# EAGLE design dropper_torpedo (EAGLE 9.6.1)
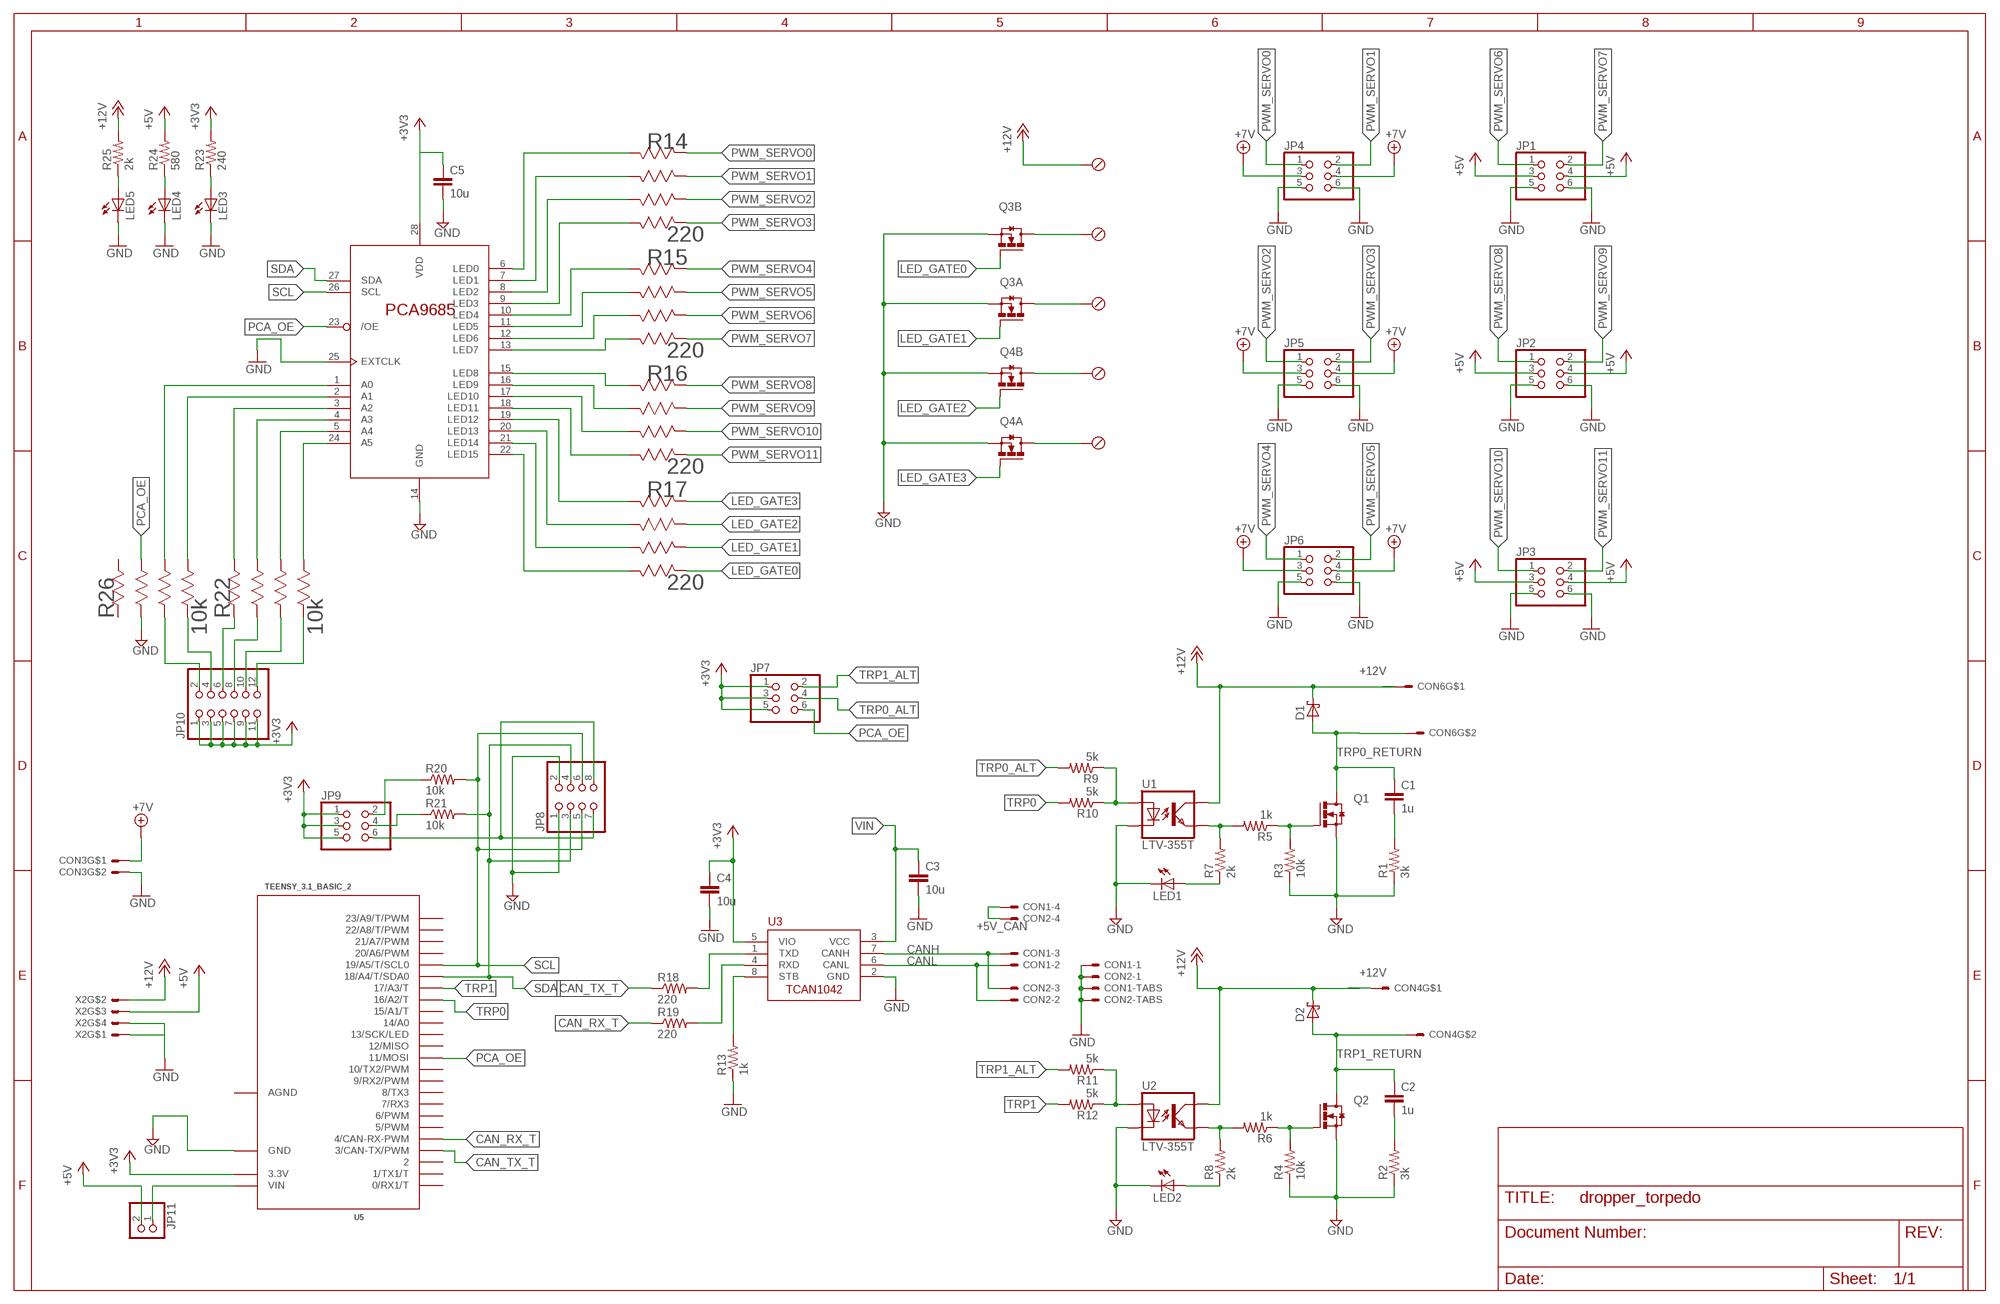
[diagram p0: schematic, sheet 1]

## Parts
C1  1u  C-EUC1206  [C1206]
C2  1u  C-EUC1206  [C1206]
C3  10u  C-EUC0805  [C0805]
C4  10u  C-EUC0805  [C0805]
C5  10u  C-EUC0805  [C0805]
CON1  SM04B-GHS-TB  [SM04B-GHS-TB]
CON2  SM04B-GHS-TB  [SM04B-GHS-TB]
CON3  MOLEX_5566-2  [5566-2]
CON4  MOLEX_5566-2  [5566-2]
CON6  MOLEX_5566-2  [5566-2]
D1  STPS1L30A  [DO214AC]
D2  STPS1L30A  [DO214AC]
JP1  PINHD-2X3  [2X03]
JP2  PINHD-2X3  [2X03]
JP3  PINHD-2X3  [2X03]
JP4  PINHD-2X3  [2X03]
JP5  PINHD-2X3  [2X03]
JP6  PINHD-2X3  [2X03]
JP7  PINHD-2X3  [2X03]
JP8  PINHD-2X4  [2X04]
JP9  PINHD-2X3  [2X03]
JP10  PINHD-2X6  [2X06]
JP11  PINHD-1X2  [1X02]
LED1  LEDCHIPLED_1206  [CHIPLED_1206]
LED2  LEDCHIPLED_1206  [CHIPLED_1206]
LED3  LEDCHIPLED_1206  [CHIPLED_1206]
LED4  LEDCHIPLED_1206  [CHIPLED_1206]
LED5  LEDCHIPLED_1206  [CHIPLED_1206]
Q1  SI4896DY-T1-E3  [SO-8]
Q2  SI4896DY-T1-E3  [SO-8]
Q3  IRL6372TRPBF  [SO-8]
Q4  IRL6372TRPBF  [SO-8]
R1  3k  R-US_R1206  [R1206]
R2  3k  R-US_R1206  [R1206]
R3  10k  R-US_R1206  [R1206]
R4  10k  R-US_R1206  [R1206]
R5  1k  R-US_R1206  [R1206]
R6  1k  R-US_R1206  [R1206]
R7  2k  R-US_R1206  [R1206]
R8  2k  R-US_R1206  [R1206]
R9  5k  R-US_R0805  [R0805]
R10  5k  R-US_R0805  [R0805]
R11  5k  R-US_R0805  [R0805]
R12  5k  R-US_R0805  [R0805]
R13  1k  R-US_R0805  [R0805]
R14  220  EXB-V8V221JVEXBV8V-M  [EXBV8V-M]
R15  220  EXB-V8V221JVEXBV8V-M  [EXBV8V-M]
R16  220  EXB-V8V221JVEXBV8V-M  [EXBV8V-M]
R17  220  EXB-V8V221JVEXBV8V-M  [EXBV8V-M]
R18  220  R-US_R0805  [R0805]
R19  220  R-US_R0805  [R0805]
R20  10k  R-US_R1206  [R1206]
R21  10k  R-US_R1206  [R1206]
R22  10k  EXB-V8V221JVEXBV8V-M  [EXBV8V-M]
R23  240  R-US_R1206  [R1206]
R24  580  R-US_R1206  [R1206]
R25  2k  R-US_R1206  [R1206]
R26  10k  EXB-V8V221JVEXBV8V-M  [EXBV8V-M]
U1  LTV-355T  [SMD4]
U2  LTV-355T  [SMD4]
U3  TCAN1042HVDR  [SO-8]
U4  PCA9685PW  [TSSOP28]
U5  TEENSY_3.1_BASIC_2  [TEENSY_3.1_BASIC_2]
X1  OSTVN05A150  [OSTVN05A150]
X2  MOLEX_5566-4  [5566-4]

## Nets
+3V3: C4.1 C5.1 JP7.1 JP7.3 JP7.5 JP9.1 JP9.3 JP9.5 JP10.1 JP10.3 JP10.5 JP10.7 JP10.9 JP10.11 R23.2 U3.5(VIO) U4.28(VDD) U5.3.3V
+5V: JP1.3 JP1.4 JP2.3 JP2.4 JP3.3 JP3.4 JP11.2 R24.2 X2.3
+5V_CAN: CON1.P$4 CON2.P$4
+7V: CON3.1 JP4.3 JP4.4 JP5.3 JP5.4 JP6.3 JP6.4
+12V: CON4.1 CON6.1 D1.C D2.C R25.2 U1.COLLECTOR(COL) U2.COLLECTOR(COL) X1.P$5 X2.2
A0: R26.6 U4.1(A0)
A0+: JP10.2 R26.3
A1: R26.5 U4.2(A1)
A1+: JP10.4 R26.4
A2: R22.8 U4.3(A2)
A2+: JP10.6 R22.1
A3: R22.7 U4.4(A3)
A3+: JP10.8 R22.2
A4: R22.6 U4.5(A4)
A4+: JP10.10 R22.3
A5: R22.5 U4.24(A5)
A5+: JP10.12 R22.4
CAN_RX: R19.2 U3.4(RXD)
CAN_RX_T: R19.1 U5.4(4/CAN-RX-PWM)
CAN_TX1: R18.2 U3.1(TXD)
CAN_TX_T: R18.1 U5.3(3/CAN-TX/PWM)
CANH: CON1.P$3 CON2.P$3 U3.7(CANH)
CANL: CON1.P$2 CON2.P$2 U3.6(CANL)
GND [net1]: C3.2 C4.2 C5.2 CON1.P$1 CON1.P$5 CON1.P$6 CON2.P$1 CON2.P$5 CON2.P$6 CON3.2 JP1.5 JP1.6 JP2.5 JP2.6 JP3.5 JP3.6 JP4.5 JP4.6 JP5.5 JP5.6 JP6.5 JP6.6 JP8.1 JP8.2 LED1.C LED2.C LED3.C LED4.C LED5.C Q1.1(S) Q1.2(S) Q1.3(S) Q2.1(S) Q2.2(S) Q2.3(S) Q3.1(B:S) Q3.3(A:S) Q4.1(B:S) Q4.3(A:S) R1.1 R2.1 R3.1 R4.1 R13.1 R26.2 U1.CATHODE(C) U2.CATHODE(C) U3.2(GND) U4.14(GND) U4.25(EXTCLK) U5.GND X2.1 X2.4
I2C_3V3: JP8.7 JP8.8 JP9.6
LED_DRAIN0: Q3.7(B:D) Q3.8(B:D) X1.P$4
LED_DRAIN1: Q3.5(A:D) Q3.6(A:D) X1.P$3
LED_DRAIN2: Q4.7(B:D) Q4.8(B:D) X1.P$2
LED_DRAIN3: Q4.5(A:D) Q4.6(A:D) X1.P$1
LED_GATE0: Q3.2(B:G) R17.4
LED_GATE1: Q3.4(A:G) R17.3
LED_GATE2: Q4.2(B:G) R17.2
LED_GATE3: Q4.4(A:G) R17.1
N$1: LED1.A R7.1
N$2: LED2.A R8.1
N$3: LED3.A R23.1
N$4: LED4.A R24.1
N$5: LED5.A R25.1
PCA_OE: JP7.6 R26.7 U4.23(/OE) U5.11(11/MOSI)
PWM_CH0: R14.8 U4.6(LED0)
PWM_CH1: R14.7 U4.7(LED1)
PWM_CH2: R14.6 U4.8(LED2)
PWM_CH3: R14.5 U4.9(LED3)
PWM_CH4: R15.8 U4.10(LED4)
PWM_CH5: R15.7 U4.11(LED5)
PWM_CH6: R15.6 U4.12(LED6)
PWM_CH7: R15.5 U4.13(LED7)
PWM_CH8: R16.8 U4.15(LED8)
PWM_CH9: R16.7 U4.16(LED9)
PWM_CH10: R16.6 U4.17(LED10)
PWM_CH11: R16.5 U4.18(LED11)
PWM_CH12: R17.8 U4.19(LED12)
PWM_CH13: R17.7 U4.20(LED13)
PWM_CH14: R17.6 U4.21(LED14)
PWM_CH15: R17.5 U4.22(LED15)
PWM_SERVO0: JP4.1 R14.1
PWM_SERVO1: JP4.2 R14.2
PWM_SERVO2: JP5.1 R14.3
PWM_SERVO3: JP5.2 R14.4
PWM_SERVO4: JP6.1 R15.1
PWM_SERVO5: JP6.2 R15.2
PWM_SERVO6: JP1.1 R15.3
PWM_SERVO7: JP1.2 R15.4
PWM_SERVO8: JP2.1 R16.1
PWM_SERVO9: JP2.2 R16.2
PWM_SERVO10: JP3.1 R16.3
PWM_SERVO11: JP3.2 R16.4
RC0: C1.2 R1.2
RC1: C2.2 R2.2
SCL: JP8.5 JP8.6 R20.2 U4.26(SCL) U5.19/A5(19/A5/T/SCL0)
SCL_3V3: JP9.2 R20.1
SDA: JP8.3 JP8.4 R21.2 U4.27(SDA) U5.18/A4(18/A4/T/SDA0)
SDA_3V3: JP9.4 R21.1
STB: R13.2 U3.8(STB)
TOPTO_A0: R9.1 R10.1 U1.ANODE(A)
TOPTO_A1: R11.1 R12.1 U2.ANODE(A)
TOPTO_E0: R5.2 R7.2 U1.EMITTER(EMIT)
TOPTO_E1: R6.2 R8.2 U2.EMITTER(EMIT)
TRP0: R10.2 U5.16/A2(16/A2/T)
TRP0_ALT: JP7.4 R9.2
TRP0_RETURN: CON6.2
TRP1: R12.2 U5.17/A3(17/A3/T)
TRP1_ALT: JP7.2 R11.2
TRP1_RETURN: C2.1 CON4.2 D2.A Q2.5(D) Q2.6(D) Q2.7(D) Q2.8(D)
TRP_GATE0: Q1.4(G) R3.2 R5.1
TRP_GATE1: Q2.4(G) R4.2 R6.1
TRP_RETURN0: C1.1 D1.A Q1.5(D) Q1.6(D) Q1.7(D) Q1.8(D)
VIN: C3.1 JP11.1 U3.3(VCC) U5.VIN
Unconnected: R26.1 R26.8 U5.0(0/RX1/T) U5.1(1/TX1/T) U5.2 U5.5(5/PWM) U5.6(6/PWM) U5.7(7/RX3) U5.8(8/TX3) U5.9(9/RX2/PWM) U5.10(10/TX2/PWM) U5.12(12/MISO) U5.13(13/SCK/LED) U5.14/A0 U5.15/A1(15/A1/T) U5.20/A6(20/A6/PWM) U5.21/A7(21/A7/PWM) U5.22/A8(22/A8/T/PWM) U5.23/A9(23/A9/T/PWM)

## Power pins joined to a net without a drawn wire
AGND: U5.AGND

## Library data of the parts
C1-C5 = rcl:C-EU: CAPACITOR, European symbol
CON1 CON2 = ARVP:SM04B-GHS-TB
CON3 CON4 CON6 = ARVP:MOLEX_5566-2
D1 D2 = dropper_torpedo_v3:STPS1L30A
JP1-JP7 JP9 = pinhead:PINHD-2X3: PIN HEADER
JP8 = pinhead:PINHD-2X4: PIN HEADER
JP10 = pinhead:PINHD-2X6: PIN HEADER
JP11 = pinhead:PINHD-1X2: PIN HEADER
LED1-LED5 = led:LED: LED OSRAM: - CHIPLED LG R971, LG N971, LY N971, LG Q971, LY Q971, LO R971, LY R971 LH N974, LH R974 LS Q976, LO Q976, LY Q976 LO Q996 - Hyper CHIPLED LW Q18S LB Q993, LB Q99A, LB R99A - SideLED LS A670, LO A670, LY A670, LG A670, LP A670 LB A673, LV A673, LT A673, LW A673 LH A674 LY A675 LS A676, LA A676, LO A676, LY A676, LW A676 LS A679, LY A679, LG A679 - Hyper Micro SIDELED® LS Y876, LA Y876, LO Y876, LY Y876 LT Y87S - SmartLED LW L88C, LW L88S LB L89C, LB L89S, LG L890 LS L89K, LO L89K, LY L89K LS L896, LA L896, LO L896, LY L896 - TOPLED LS T670, LO T670, LY T670, LG T670, LP T670 LSG T670, LSP T670, LSY T670, LOP T670, LYG T670 LG T671, LOG T671, LSG T671 LB T673, LV T673, LT T673, LW T673 LH T674 LS T676, LA T676, LO T676, LY T676, LB T676, LH T676, LSB T676, LW T676 LB T67C, LV T67C, LT T67C, LS T67K, LO T67K, LY T67K, LW E67C LS E67B, LA E67B, LO E67B, LY E67B, LB E67C, LV E67C, LT E67C LW T67C LS T679, LY T679, LG T679 LS T770, LO T770, LY T770, LG T770, LP T770 LB T773, LV T773, LT T773, LW T773 LH T774 LS E675, LA E675, LY E675, LS T675 LS T776, LA T776, LO T776, LY T776, LB T776 LHGB T686 LT T68C, LB T68C - Hyper Mini TOPLED® LB M676 - Mini TOPLED Santana® LG M470 LS M47K, LO M47K, LY M47K Source: http://www.osram.convergy.de LUXEON: - LUMILED® LXK2-PW12-R00, LXK2-PW12-S00, LXK2-PW14-U00, LXK2-PW14-V00 LXK2-PM12-R00, LXK2-PM12-S00, LXK2-PM14-U00 LXK2-PE12-Q00, LXK2-PE12-R00, LXK2-PE12-S00, LXK2-PE14-T00, LXK2-PE14-U00 LXK2-PB12-K00, LXK2-PB12-L00, LXK2-PB12-M00, LXK2-PB14-N00, LXK2-PB14-P00, LXK2-PB14-Q00 LXK2-PR12-L00, LXK2-PR12-M00, LXK2-PR14-Q00, LXK2-PR14-R00 LXK2-PD12-Q00, LXK2-PD12-R00, LXK2-PD12-S00 LXK2-PH12-R00, LXK2-PH12-S00 LXK2-PL12-P00, LXK2-PL12-Q00, LXK2-PL12-R00 Source: www.luxeon.com KINGBRIGHT: KA-3528ASYC Source: www.kingbright.com
Q1 Q2 = dropper_torpedo_v3:SI4896DY-T1-E3
Q3 Q4 = dropper_torpedo_v3:IRL6372TRPBF
R1-R13 R18-R21 R23-R25 = rcl:R-US_: RESISTOR, American symbol
R14-R17 R22 R26 = ARVP:EXB-V8V221JV; MANUFACTURER_PART_NUMBER: EXBV8V221JV; VENDOR: Panasonic
U1 U2 = dropper_torpedo_v3:LTV-355T
U3 = ARVP:TCAN1042HVDR
U4 = dropper_torpedo_v3:PCA9685
U5 = Teensy_3_Series_Board_v1.0:TEENSY_3.1_BASIC_2: Footprint for Teensy 3.1 board using all pin connections on the outer perimeter
X1 = dropper_torpedo_v3:OSTVN05A150
X2 = ARVP:MOLEX_5566-4

## Net classes
1 net1: clearance 0.203 mm to class 0

## Board
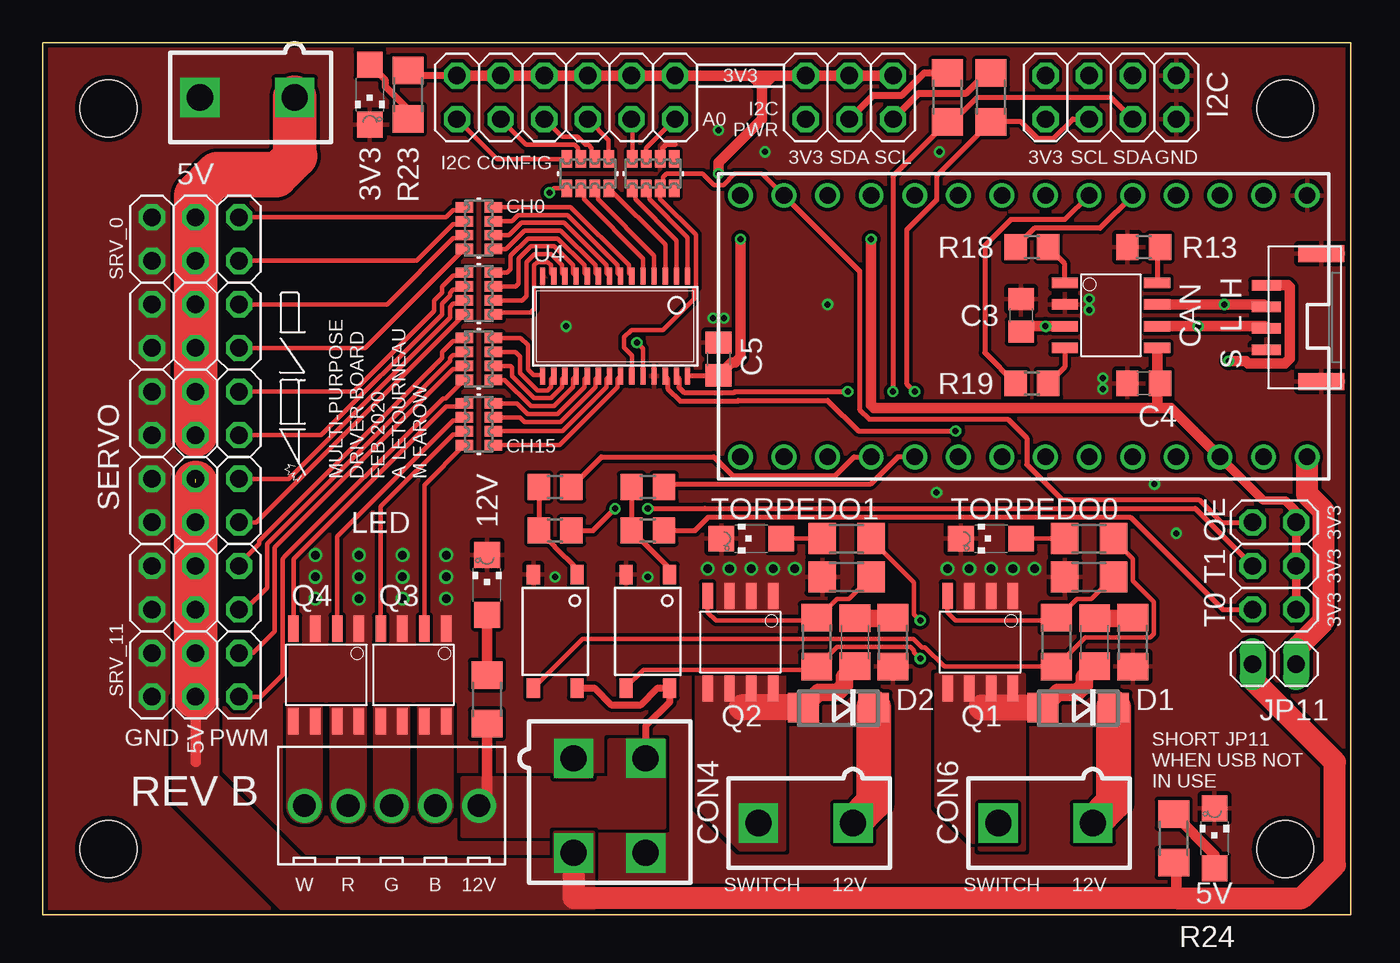
[diagram p1: board, top side]
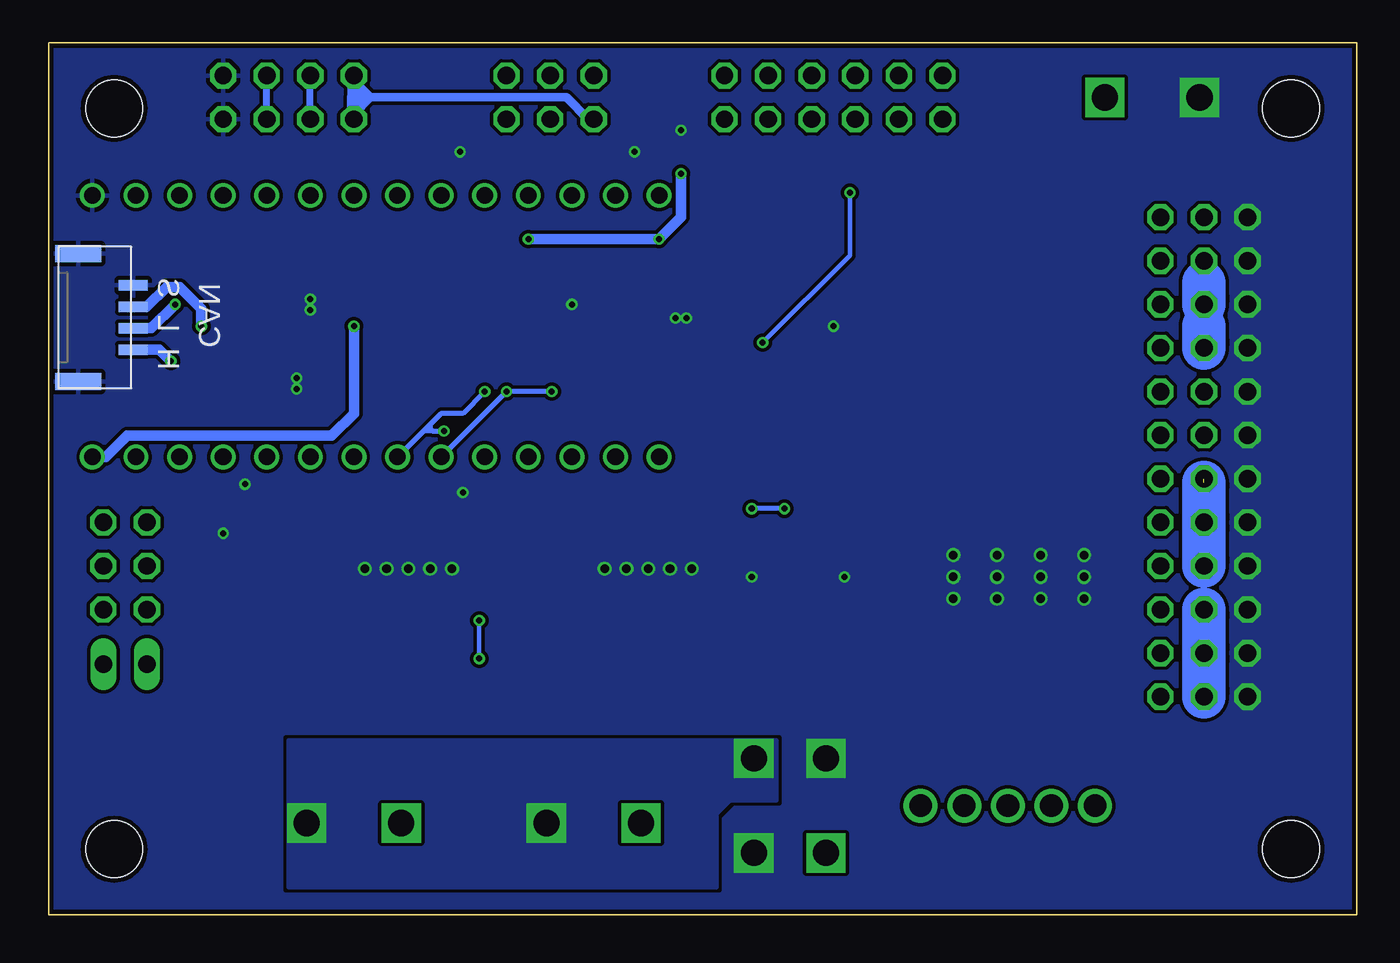
[diagram p2: board, bottom side, seen from below]

Size 76.2 x 50.8 mm. Coordinates in mm from the lower left corner, seen from the top.
Outline: 0,0 76.2,0 76.2,50.8 0,50.8 0,0
Copper layers (1*16): Top 0.035mm / dielectric 1.5mm / Bottom 0.035mm
Design rules "ITEADstudioDRC": minimum track width 6mil, minimum drill 12mil, track to track 8mil, track to pad 8mil, pad to pad 8mil, via to via 8mil, smd to smd 0mil, copper to edge 10mil, drill to drill 10mil, minimum pad ring 6mil, minimum via ring 6mil, stop-mask expansion 2mil, vias tented up to drill 100mil, thermal gap 10mil
Milling: 4 lines

### Footprints (pad centres in the part's own frame; a part is rotated, then mirrored left to right if it is on the bottom)
C1206 = smd 1.6 x 1.8: 1 -1.4,0; 2 1.4,0
C0805 = smd 1.3 x 1.5: 1 -0.95,0; 2 0.95,0
SM04B-GHS-TB = smd 0.6 x 1.7: P$1 -1.875,0.85; P$2 -0.625,0.85; P$3 0.625,0.85; P$4 1.875,0.85 | smd 1 x 2.7: P$5 -3.725,-2.35; P$6 3.725,-2.35
5566-2 = drill 1.524 square: 1 0,-2.756; 2 0,2.756
DO214AC = smd 1.8 x 1.7: A 2.05,0; C -2.05,0
2X03 = drill 1.016 octagon: 1 -2.54,-1.27; 2 -2.54,1.27; 3 0,-1.27; 4 0,1.27; 5 2.54,-1.27; 6 2.54,1.27
2X04 = drill 1.016 octagon: 1 -3.81,-1.27; 2 -3.81,1.27; 3 -1.27,-1.27; 4 -1.27,1.27; 5 1.27,-1.27; 6 1.27,1.27; 7 3.81,-1.27; 8 3.81,1.27
2X06 = drill 1.016 octagon: 1 -6.35,-1.27; 2 -6.35,1.27; 3 -3.81,-1.27; 4 -3.81,1.27; 5 -1.27,-1.27; 6 -1.27,1.27; 7 1.27,-1.27; 8 1.27,1.27; 9 3.81,-1.27; 10 3.81,1.27; 11 6.35,-1.27; 12 6.35,1.27
1X02 = drill 1.016 long: 1 -1.27,0; 2 1.27,0
CHIPLED_1206 = smd 1.5 x 1.5: A 0,-1.75; C 0,1.75
SO-8 = smd 1.524 x 0.61: 1 -2.692,1.905; 2 -2.692,0.635; 3 -2.692,-0.635; 4 -2.692,-1.905; 5 2.692,-1.905; 6 2.692,-0.635; 7 2.692,0.635; 8 2.692,1.905
R1206 = smd 1.6 x 1.803: 1 -1.422,0; 2 1.422,0
R0805 = smd 1.3 x 1.5: 1 -0.95,0; 2 0.95,0
EXBV8V-M = smd 1.016 x 0.61: 1 -0.851,1.219; 2 -0.851,0.406; 3 -0.851,-0.406; 4 -0.851,-1.219; 5 0.851,-1.219; 6 0.851,-0.406; 7 0.851,0.406; 8 0.851,1.219
SMD4 = smd 0.762 x 1.143: ANODE -1.27,-3.302; CATHODE 1.27,-3.302; COLLECTOR -1.27,3.302; EMITTER 1.27,3.302
TSSOP28 = smd 0.305 x 0.991: 1 -4.225,-2.918; 2 -3.575,-2.918; 3 -2.925,-2.918; 4 -2.275,-2.918; 5 -1.625,-2.918; 6 -0.975,-2.918; 7 -0.325,-2.918; 8 0.325,-2.918; 9 0.975,-2.918; 10 1.625,-2.918; 11 2.275,-2.918; 12 2.925,-2.918; 13 3.575,-2.918; 14 4.225,-2.918; 15 4.225,2.918; 16 3.575,2.918; 17 2.925,2.918; 18 2.275,2.918; 19 1.625,2.918; 20 0.975,2.918; 21 0.325,2.918; 22 -0.325,2.918; 23 -0.975,2.918; 24 -1.625,2.918; 25 -2.275,2.918; 26 -2.925,2.918; 27 -3.575,2.918; 28 -4.225,2.918
TEENSY_3.1_BASIC_2 = drill 0.965: 0 -7.62,13.97; 1 -7.62,11.43; 2 -7.62,8.89; 3 -7.62,6.35; 3.3V 7.62,11.43; 4 -7.62,3.81; 5 -7.62,1.27; 6 -7.62,-1.27; 7 -7.62,-3.81; 8 -7.62,-6.35; 9 -7.62,-8.89; 10 -7.62,-11.43; 11 -7.62,-13.97; 12 -7.62,-16.51; 13 7.62,-16.51; 14/A0 7.62,-13.97; 15/A1 7.62,-11.43; 16/A2 7.62,-8.89; 17/A3 7.62,-6.35; 18/A4 7.62,-3.81; 19/A5 7.62,-1.27; 20/A6 7.62,1.27; 21/A7 7.62,3.81; 22/A8 7.62,6.35; 23/A9 7.62,8.89; AGND 7.62,13.97; GND -7.62,16.51; VIN 7.62,16.51
STAND-OFF = hole 3.302: 0,0
OSTVN05A150 = drill 1.321: P$1 -5.08,0; P$2 -2.54,0; P$3 0,0; P$4 2.54,0; P$5 5.08,0
5566-4 = drill 1.524 square: 1 2.101,-2.756; 2 -2.101,-2.756; 3 2.101,2.756; 4 -2.101,2.756

### Placement (x,y rotation side)
C1  61.28,15.88 90 top
C2  47.31,15.88 90 top
C3  56.99,34.92 90 top
C4  64.14,30.96 180 top
C5  39.37,32.38 90 top
CON1  72.14,34.8 90 top
CON2  72.14,34.8 270 bottom
CON3  11.91,47.62 90 top
CON4  44.45,5.33 90 top
CON6  58.42,5.33 90 top
D1  60.33,12.06 180 top
D2  46.35,12.06 180 top
JP1  8.89,24.13 180 top
JP2  8.89,19.05 180 top
JP3  8.89,13.97 180 top
JP4  8.89,39.37 180 top
JP5  8.89,34.29 180 top
JP6  8.89,29.21 180 top
JP7  71.75,20.32 90 top
JP8  62.23,47.62 180 top
JP9  46.99,47.62 180 top
JP10  30.48,47.62 180 top
JP11  71.75,14.61 180 top
LED1  55.24,21.91 90 top
LED2  41.27,21.91 90 top
LED3  19.05,47.78 180 top
LED4  68.26,4.45 0 top
LED5  25.88,19.21 0 top
Q1  54.61,15.88 270 top
Q2  40.64,15.88 270 top
Q3  21.59,13.97 270 top
Q4  16.51,13.97 270 top
R1  63.5,15.88 90 top
R2  49.53,15.88 90 top
R3  60.96,19.68 0 top
R4  46.83,19.68 0 top
R5  59.05,15.88 270 top
R6  45.09,15.88 270 top
R7  60.96,21.91 0 top
R8  46.83,21.91 0 top
R9  29.84,22.38 0 top
R10  29.84,24.92 0 top
R11  35.24,22.38 0 top
R12  35.24,24.92 0 top
R13  64.14,38.89 0 top
R14  25.4,40.01 0 top
R15  25.4,36.2 0 top
R16  25.4,32.38 0 top
R17  25.4,28.57 0 top
R18  57.63,38.89 0 top
R19  57.63,30.96 0 top
R20  55.24,47.62 270 top
R21  52.7,47.62 270 top
R22  31.75,43.18 270 top
R23  21.27,47.78 90 top
R24  65.88,4.45 270 top
R25  25.88,12.54 270 top
R26  35.56,43.18 270 top
U1  29.84,16.51 180 top
U2  35.24,16.51 180 top
U3  62.23,34.92 0 top
U4  33.34,34.29 180 top
U5  57.15,34.29 270 top
U$5  [LOGO3]  15.24,25.4 90 top
U$6  [LETTER_L]  -82.55,-72.39 0 top  (outside the outline)
U$7  [DOCFIELD]  64.77,-72.39 0 top  (outside the outline)
U$8  [STAND-OFF]  72.39,3.81 0 top
U$9  [STAND-OFF]  3.81,3.81 0 top
U$10  [STAND-OFF]  3.81,46.99 0 top
U$11  [STAND-OFF]  72.39,46.99 0 top
X1  20.32,6.35 0 top
X2  33.02,6.35 180 top

### Tracks (layer width: path | path; a pad name or v marks a point on that pad's centre or on a via)
+3V3  (via drill 0.35)
  Top 0.305: C5.1 39.3,31.37 U4.28
  Top 0.406: JP10.11 21.58,48.9 R23.2
  Top 0.508: U5.3.3V 71.12,24.13 72.39,24.13 73.03,23.5 JP7.5 JP7.3 JP7.1
  Top 0.61: v39.37,43.18 39.37,43.81 41.91,46.35 41.91,48.26 | JP9.1 JP9.3 JP9.5 42.55,48.9 | U3.5 64.92,31.12 C4.1 64.93,30.8 64.93,29.53 | 42.55,48.9 41.91,48.26 | 41.91,48.26 41.27,48.9 | 41.27,48.9 JP10.1 JP10.3 JP10.5 JP10.7 JP10.9 JP10.11 | 41.27,48.9 42.55,48.9 | C5.1 40.11,32.18 40.33,32.18 40.64,32.49 v40.64,39.37 | U5.3.3V 65.72,29.53 64.93,29.53 | 64.93,29.53 48.42,29.53 48.26,29.69 v48.26,39.37
  Bottom 0.61: v39.37,43.18 39.37,40.64 v40.64,39.37 v48.26,39.37
+5V  (1 unrouted)
  Top 0.152: JP1.4 8.89,24.13
  Top 0.61: JP3.4 8.89,8.89 | R24.2 66.04,2.86 66.04,0.95
  Top 1.27: X2.3 30.92,0.95 66.04,0.95 73.34,0.95 75.27,2.88 75.27,8.89 70.48,13.68 JP11.2
  Top 2.54: JP3.4 JP3.3 JP2.4 JP2.3 JP1.4 8.89,25.2
  Bottom 2.54: JP2.3 JP1.4 8.89,25.2 | JP3.3 8.89,16.51 | JP2.4 JP3.3 | 8.89,13.97 JP3.4 JP3.3
  pour Top (no thermals): 29.84,4.76 29.84,3.17 15.08,3.17 10.16,8.1 10.16,12.54 10,12.7 7.78,12.7 7.62,12.54 7.62,6.67 13.97,0.32 32.07,0.32 32.07,4.76
+5V_CAN  (via drill 0.35)
  Top 0.61: v69.09,32.26 70.08,32.26 70.23,32.12 72.35,32.12 72.64,32.41 72.64,36.58 72.55,36.67 CON1.P$4
  Bottom 0.61: CON2.P$4 69.75,32.92 v69.09,32.26
+7V
  Top 2.54: 10.16,43.18 8.89,41.91 JP4.3 JP4.4 JP5.3 JP5.4 JP6.3 JP6.4 | 13.59,43.05 14.73,44.2 14.66,44.27 CON3.1 | 13.59,43.05 10.29,43.05 10.16,43.18 | 13.59,43.05 13.46,43.18 10.16,43.18
  Bottom 2.54: JP5.3 8.89,36.83 | JP5.4 8.89,34.29
+12V
  Top 0.406: 25.47,6.35 X1.P$5 | U1.COLLECTOR 32.13,13.21 33.11,12.23 34.84,12.23 35.82,13.21 U2.COLLECTOR 36.51,12.38 35.12,10.99 X2.2
  Top 0.61: X1.P$5 25.88,6.83 R25.2
  Top 2.032: D1.C 62.38,6.53 CON6.1 | D2.C 48.41,6.53 CON4.1
  pour Bottom (no thermals): 62.23,10.16 62.23,1.59 37.31,1.59 37.31,5.87 36.51,6.67 33.81,6.67 33.81,10.16
  pour Top (rank 2, no thermals): 36.2,10.16 36.2,5.08 31.91,5.08 31.91,4.6 24.45,4.6 24.45,7.94 33.02,7.94 33.02,10.16
A0
  Top 0.254: R26.6 35.33,42.15 35.33,41.68 37.56,39.45 U4.1
A0+
  Top 0.254: R26.3 35.15,44.68 JP10.2
A1
  Top 0.254: R26.5 34.52,42.15 34.52,41.68 36.91,39.29 U4.2
A1+
  Top 0.254: R26.4 34.34,46.3 JP10.4
A2
  Top 0.254: U4.3 36.26,39.04 R22.8
A2+
  Top 0.254: R22.1 32.97,45.14 JP10.6
A3
  Top 0.254: R22.7 32.33,42.15 32.33,41.68 35.61,38.41 U4.4
A3+
  Top 0.254: JP10.8 30.24,45.33 31.16,45.33 31.62,44.87 31.79,44.87 31.98,44.68 31.98,44.21 R22.2
A4
  Top 0.254: R22.6 31.52,42.15 31.52,41.68 34.96,38.24 U4.5
A4+
  Top 0.254: R22.3 31.17,44.21 31.17,44.68 30.97,44.87 28.16,44.87 JP10.10
A5  (via drill 0.35)
  Top 0.254: R22.5 29.79,42.33 v29.53,42.07 | v34.61,33.34 34.96,32.98 U4.24
  Bottom 0.254: v29.53,42.07 29.53,38.42 v34.61,33.34
A5+
  Top 0.254: R22.4 26.45,44.03 JP10.12
CAN_RX
  Top 0.305: U3.4 59.54,31.92 R19.2
CAN_RX_T
  Top 0.305: U5.4 59.56,40.51 56.39,40.51 54.88,39 54.88,32.75 R19.1
CAN_TX1
  Top 0.305: U3.1 59.54,37.93 R18.2
CAN_TX_T
  Top 0.305: U5.3 61.59,40 57.78,40 57.57,39.79 R18.1
CANH  (via drill 0.35)
  Top 0.61: U3.7 v68.83,35.56 71.15,35.56 CON1.P$3
  Bottom 0.61: v68.83,35.56 70.22,34.17 CON2.P$3
CANL  (via drill 0.35)
  Top 0.61: U3.6 v67.31,34.29 71.17,34.29 CON1.P$2
  Bottom 0.61: v67.31,34.29 67.31,35.31 68.58,36.58 69.34,36.58 70.5,35.42 CON2.P$2
GND  (via drill 0.35, 0.5)
  Top 0.305: R26.2 36.12,44.18 36.12,44.69 36.33,44.9 36.8,44.9 | 36.83,44.93 36.83,44.9
  other vias: 56.52,20.16 55.24,20.16 53.98,20.16 52.7,20.16 57.78,20.16 42.55,20.16 41.27,20.16 40.01,20.16 38.73,20.16 43.81,20.16 15.88,19.68 15.88,18.41 18.41,19.68 18.41,18.41 20.95,19.68 20.95,18.41 23.5,19.68 23.5,18.41 15.88,20.95 18.41,20.95 20.95,20.95 23.5,20.95 30.48,34.29 39.37,45.72 61.75,31.27 61.75,30.64 60.96,35.88 60.96,35.24 39.05,34.77 39.69,34.77 52.07,24.61 66.04,22.23 35.24,19.68 29.84,19.68 45.72,35.56 42.07,44.45 64.77,25.08 52.23,44.45
  pour Top (no thermals): 53.34,17.62 53.34,19.68 52.07,19.68 52.07,20.64 58.1,20.64 58.1,18.89 57.15,18.89 57.15,17.62
  pour Top (no thermals): 39.37,17.62 39.37,19.68 38.1,19.68 38.1,20.64 44.29,20.64 44.29,18.89 43.18,18.89 43.18,17.62
  pour Bottom (rank 3, no thermals): 29.53,10.64 29.53,2.06 36.51,2.06 36.51,10.64
  pour Top (no thermals): 15.24,15.72 15.24,21.59 16.51,21.59 16.51,15.72
  pour Top (no thermals): 17.78,15.56 17.78,21.59 19.05,21.59 19.05,15.56
  pour Top (no thermals): 20.32,15.72 20.32,21.59 21.59,21.59 21.59,15.72
  pour Top (no thermals): 22.86,15.72 22.86,21.59 24.13,21.59 24.13,15.72
  pour Bottom (no thermals): 5.08,41.91 7.62,41.91 7.62,11.43 5.08,11.43
  pour Top (rank 3, no thermals): 29.37,10.64 29.37,2.22 36.51,2.06 36.51,10.64
  pour Top (rank 2, no thermals): 5.08,41.91 7.62,41.91 7.62,11.43 5.08,11.43
  pour Top (no thermals): 11.27,46.2 11.27,49.05 7.14,49.05 7.14,46.2
  pour Bottom (no thermals): 11.27,46.2 11.27,49.05 7.14,49.05 7.14,46.2
  pour Bottom (rank 2): 0.32,0.32 75.88,0.32 75.88,50.48 0.32,50.48
  pour Top (rank 3): 0.32,0.32 75.88,0.32 75.88,50.48 0.32,50.48
I2C_3V3
  Bottom 0.508: JP9.6 44.77,46.35 46.04,47.62 58.42,47.62 | 58.42,48.58 57.47,47.62 58.42,46.67
  Bottom 0.813: JP8.7 58.42,48.58 58.42,47.62 58.42,46.67 JP8.8
LED_DRAIN0
  pour Top (no thermals): 21.91,12.06 23.81,12.06 23.81,6.35 arc-90 22.86,5.4 arc-90 21.91,6.35
LED_DRAIN1
  pour Top (no thermals): 19.37,12.06 21.27,12.06 21.27,6.35 arc-90 20.32,5.4 arc-90 19.37,6.35
LED_DRAIN2
  pour Top (no thermals): 16.83,12.06 18.73,12.06 18.73,6.35 arc-90 17.78,5.4 arc-90 16.83,6.35
LED_DRAIN3
  pour Top (no thermals): 14.29,12.06 16.19,12.06 16.19,6.35 arc-90 15.24,5.4 arc-90 14.29,6.35
LED_GATE0
  Top 0.254: Q3.2 22.23,25.03 R17.4
LED_GATE1
  Top 0.254: R17.3 24.37,27.99 23.9,27.99 19.68,23.77 Q3.4
LED_GATE2
  Top 0.254: R17.2 24.37,28.8 23.9,28.8 17.14,22.04 Q4.2
LED_GATE3
  Top 0.254: R17.1 24.37,29.62 23.5,29.62 14.61,20.72 Q4.4
N$1
  Top 0.254: R7.1 LED1.A
N$2
  Top 0.254: R8.1 LED2.A
N$3
  Top 0.406: LED3.A 19.96,48.62 19.96,48.24 21.27,46.93 R23.1
N$4
  Top 0.61: R24.1 68.26,3.49 LED4.A
N$5
  Top 0.61: R25.1 LED5.A
PCA_OE
  Top 0.254: U4.23 34.31,32.59 33.87,33.03 33.87,33.64 34.3,34.07 36.14,34.07 37.94,35.88 37.94,36.47 38.05,36.58 38.05,39.62 35.97,41.7 R26.7 36.14,42.51 36.14,42.97 36.34,43.17 36.82,43.17 36.83,43.18 38.44,43.18 39.1,42.52 39.64,42.52 40.3,43.18 41.91,43.18 U5.11
  Top 0.305: U5.11 47.58,37.51 47.58,29.43 48.15,28.87 56.22,28.87 57.33,27.76 57.33,26.22 59.37,24.18 67.34,24.18 68.66,22.86 JP7.6
PWM_CH0
  Top 0.254: U4.6 34.15,37.38 34.15,37.84 30.75,41.23 27.5,41.23 27.49,41.22 R14.8
PWM_CH1
  Top 0.254: U4.7 33.49,37.38 33.49,37.84 30.56,40.78 27.69,40.78 27.32,40.41 R14.7
PWM_CH2
  Top 0.254: U4.8 32.84,37.38 32.84,37.84 30.37,40.32 27.88,40.32 27.16,39.6 R14.6
PWM_CH3
  Top 0.254: U4.9 32.2,37.38 32.2,37.84 30.17,39.86 28.07,39.86 26.99,38.79 R14.5
PWM_CH4
  Top 0.254: U4.10 31.55,37.38 31.55,37.84 29.98,39.41 28.25,39.41 27.26,38.41 27.26,37.62 27.05,37.41 R15.8
PWM_CH5
  Top 0.254: U4.11 30.89,37.38 30.89,37.84 29.79,38.95 28.45,38.95 27.71,38.22 27.71,36.76 27.55,36.6 R15.7
PWM_CH6
  Top 0.254: U4.12 30.25,37.38 30.25,37.84 29.59,38.49 28.63,38.49 28.17,38.03 28.17,36.04 27.93,35.79 R15.6
PWM_CH7
  Top 0.254: U4.13 29.59,37.38 29.59,37.84 29.4,38.03 28.82,38.03 28.63,37.84 28.63,35.3 28.42,35.08 26.36,35.08 R15.5
PWM_CH8
  Top 0.254: U4.15 29.05,31.43 28.57,31.43 28.26,31.75 28.26,33.18 27.83,33.6 R16.8
PWM_CH9
  Top 0.254: U4.16 29.59,31.2 29.59,30.74 29.4,30.55 28.81,30.55 27.8,31.56 27.8,32.52 27.53,32.79 R16.7
PWM_CH10
  Top 0.254: U4.17 30.25,31.2 30.25,30.74 29.59,30.09 28.62,30.09 27.34,31.37 27.34,31.87 27.23,31.98 R16.6
PWM_CH11
  Top 0.254: U4.18 30.89,31.2 30.89,30.74 29.79,29.63 28.43,29.63 26.9,31.17 R16.5
PWM_CH12
  Top 0.254: U4.19 31.55,31.2 31.55,30.74 29.98,29.18 28.25,29.18 27.63,29.79 R17.8
PWM_CH13
  Top 0.254: U4.20 32.2,31.2 32.2,30.74 30.17,28.72 28.06,28.72 27.79,28.98 R17.7
PWM_CH14
  Top 0.254: U4.21 32.84,31.2 32.84,30.74 30.27,28.17 R17.6
PWM_CH15
  Top 0.254: U4.22 33.49,31.2 33.49,30.74 30.11,27.36 R17.5
PWM_SERVO0
  Top 0.254: R14.1 24.37,41.05 23.9,41.05 23.5,40.64 JP4.1
PWM_SERVO1
  Top 0.254: R14.2 24.37,40.23 23.9,40.23 21.77,38.1 JP4.2
PWM_SERVO2
  Top 0.254: R14.3 24.37,39.42 23.9,39.42 20.04,35.56 JP5.1
PWM_SERVO3
  Top 0.254: JP5.2 18.78,33.02 R14.4
PWM_SERVO4
  Top 0.254: JP6.1 18.11,30.48 22.8,35.16 22.8,35.8 23.25,36.25 23.25,36.59 23.9,37.24 24.37,37.24 R15.1
PWM_SERVO5
  Top 0.254: JP6.2 16.22,27.94 23.25,34.97 23.25,35.61 23.71,36.06 23.71,36.23 23.9,36.42 24.37,36.42 R15.2
PWM_SERVO6
  Top 0.254: R15.3 24.37,35.61 23.9,35.61 23.71,35.42 23.71,34.78 14.33,25.4 JP1.1
PWM_SERVO7
  Top 0.254: R15.4 12.43,22.86 JP1.2
PWM_SERVO8
  Top 0.254: R16.1 24.37,33.43 23.9,33.43 23.25,32.78 23.25,32.44 12.6,21.79 12.6,21.59 11.43,20.42 JP2.1
PWM_SERVO9
  Top 0.254: R16.2 24.37,32.61 23.9,32.61 23.71,32.42 23.71,32.25 13.06,21.6 13.06,19.05 11.79,17.78 JP2.2
PWM_SERVO10
  Top 0.254: R16.3 24.37,31.8 23.9,31.8 13.51,21.41 13.51,16.51 12.24,15.24 JP3.1
PWM_SERVO11
  Top 0.254: R16.4 23.46,30.07 23.31,30.07 14.13,20.89 13.97,20.74 13.97,13.97 12.7,12.7 JP3.2
RC0
  Top 1.016: C1.2 63.48,17.27
  Top 1.27: 63.48,17.27 R1.2
RC1
  Top 1.016: C2.2 49.51,17.27
  Top 1.27: 49.51,17.27 R2.2
SCL  (via drill 0.35)
  Top 0.305: JP8.6 60,46.35 58.88,45.24 57.96,45.24 56.99,46.2 R20.2 52.07,43.03 52.07,41.63 50.32,39.89 50.32,30.96 v50.8,30.48 | U4.26 36.4,31.23 36.4,30.66 37.14,29.92 40.48,29.92 40.53,29.97 45.72,29.97 47.51,28.18 v53.18,28.18
  Bottom 0.305: v50.8,30.48 52.07,29.21 53.34,29.21 53.98,28.57 | 54.37,28.18 U5.19/A5 | 54.37,28.18 53.98,28.57 | v53.18,28.18 v53.19,28.18 53.82,28.18 | 53.82,28.18 54.37,28.18 | 53.98,28.57 53.98,28.34 53.82,28.18
  Bottom 0.406: JP8.6 JP8.5
SCL_3V3
  Top 0.406: R20.1 54.98,49.05 53.77,47.84 51.02,47.84 JP9.2
SDA  (via drill 0.35)
  Top 0.305: JP8.4 62.23,47.62 54.45,47.62 53.03,46.2 R21.2 49.53,43.03 v49.53,30.48 | U4.27 37.05,31.23 37.05,30.73 37.35,30.43 40.27,30.43 40.32,30.48 v46.89,30.48
  Bottom 0.305: U5.18/A4 v49.53,30.48 v46.89,30.48
  Bottom 0.406: JP8.4 JP8.3
SDA_3V3
  Top 0.406: R21.1 51.33,49.05 50.01,47.73 48.36,47.73 JP9.4
STB
  Top 0.305: R13.2 64.92,38.73 U3.8
TOPTO_A0
  Top 0.305: U1.ANODE 31.11,20.16 29.79,21.49 R9.1 R10.1
TOPTO_A1
  Top 0.305: U2.ANODE 36.51,20.16 35.19,21.49 R11.1 R12.1
TOPTO_E0
  Top 0.254: U1.EMITTER 31.43,16.06 50.74,16.06 51.22,15.58 51.39,15.58 52.52,14.45 R5.2 60.75,16.14 64.52,16.14 64.73,16.36 64.73,18.23 63.51,19.45 63.51,20.72 62.38,21.85 R7.2
TOPTO_E1  (via drill 0.35)
  Top 0.254: U2.EMITTER 33.92,13.21 34.98,14.28 44.91,14.28 R6.2 45.12,14.45 46.27,15.61 50.55,15.61 50.76,15.39 50.76,15.28 v51.12,14.92 | v51.12,17.14 50.76,17.5 50.76,19.34 48.25,21.85 R8.2
  Bottom 0.254: v51.12,14.92 v51.12,17.14
TRP0
  Top 0.305: R10.2 32.54,26.67 39.09,26.67 40.19,25.58 46.17,25.58 47.27,26.67 U5.16/A2
TRP0_ALT  (via drill 0.35)
  Top 0.305: R9.2 32.07,22.38 v33.34,23.65 | v35.24,23.65 38.55,23.65 38.57,23.67 67.13,23.67 JP7.4
  Bottom 0.305: v33.34,23.65 v35.24,23.65
TRP1
  Top 0.305: U5.17/A3 49.8,26.67 48.2,25.07 36.34,25.07 R12.2
TRP1_ALT
  Top 0.305: R11.2 38,22.38 38.78,23.16 63.35,23.16 68.74,17.78 JP7.2
TRP1_RETURN
  Top 1.016: D2.A 45.18,12.94 46.28,12.94 46.7,13.36 46.7,13.87 C2.1
  Top 1.524: D2.A 40.72,12.06
  pour Top (no thermals): 43.18,3.81 43.18,13.97 38.1,13.97 38.1,6.35 40.64,3.81
TRP_GATE0
  Top 0.254: 58.9,17.14 R5.1 | Q1.4 52.7,17.62 53.18,17.14 58.9,17.14 | R3.2 61.1,18.41 60.24,18.41 58.98,17.14 58.9,17.14
TRP_GATE1
  Top 0.254: 44.93,17.14 R6.1 | Q2.4 38.73,17.62 39.21,17.14 44.77,17.14 44.93,17.14 | R4.2 46.97,18.41 46.27,18.41 45.01,17.14 44.93,17.14
TRP_RETURN0
  Top 1.016: D1.A 59.15,12.94 60.25,12.94 60.67,13.36 60.67,13.87 C1.1
  Top 1.524: 54.69,12.06 D1.A
  pour Top (no thermals): 54.61,3.81 52.07,6.35 52.07,13.97 57.15,13.97 57.15,3.81
VIN  (via drill 0.35)
  Top 0.61: U3.3 v58.42,34.29 57.15,34.29 C3.1
  Top 1.27: JP11.1 73.03,15.52 74.62,17.12 74.62,23.52 73.66,24.49 U5.VIN
  Bottom 0.61: U5.VIN 72.88,26.67 71.64,27.91 59.72,27.91 58.42,29.21 v58.42,34.29

### Text on the board
tNames: 3V3 | I2C | A0 | I2C / PWR | 3V3 | I2C CONFIG | 3V3 | SDA | SCL | 3V3 | SCL | SDA | GND | 5V | SRV_0 | CH0 | H | CAN | L | S | SERVO | CH15 | MULTI-PURPOSE / DRIVER BOARD / FEB 2020 / A LETOURNEAU / M FAROW | TORPEDO1 | TORPEDO0 | LED | 12V | OE | 3V3 | T1 | 3V3 | T0 | 3V3 | SRV_11 | 5V | SHORT JP11 / WHEN USB NOT / IN USE | GND | PWM | REV B | W | R | G | B | 12V | SWITCH | 12V | SWITCH | 12V | 5V
bNames: S | CAN | L | H